# EAGLE schematic voltDividerClass (EAGLE 9.5.0)
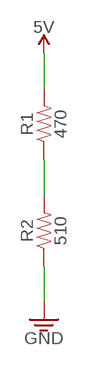
[diagram p0: schematic, sheet 1]

## Parts
R1  470  RESISTORAXIAL-0.3  [AXIAL-0.3]
R2  510  RESISTORAXIAL-0.3  [AXIAL-0.3]

## Nets
3.3V: R2.P$1 ; supply symbol labelled GND
5V: R1.P$2
N$1: R1.P$1 R2.P$2

## Library data of the parts
R1 R2 = SparkFun-Resistors:RESISTOR: Generic Resistor Package